# EAGLE design 16ChFNIRS (EAGLE 9.6.2)
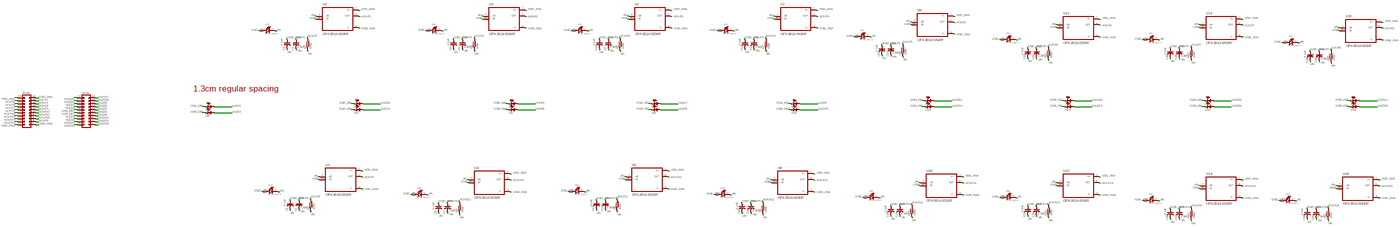
[diagram p0: schematic, sheet 1, overview]
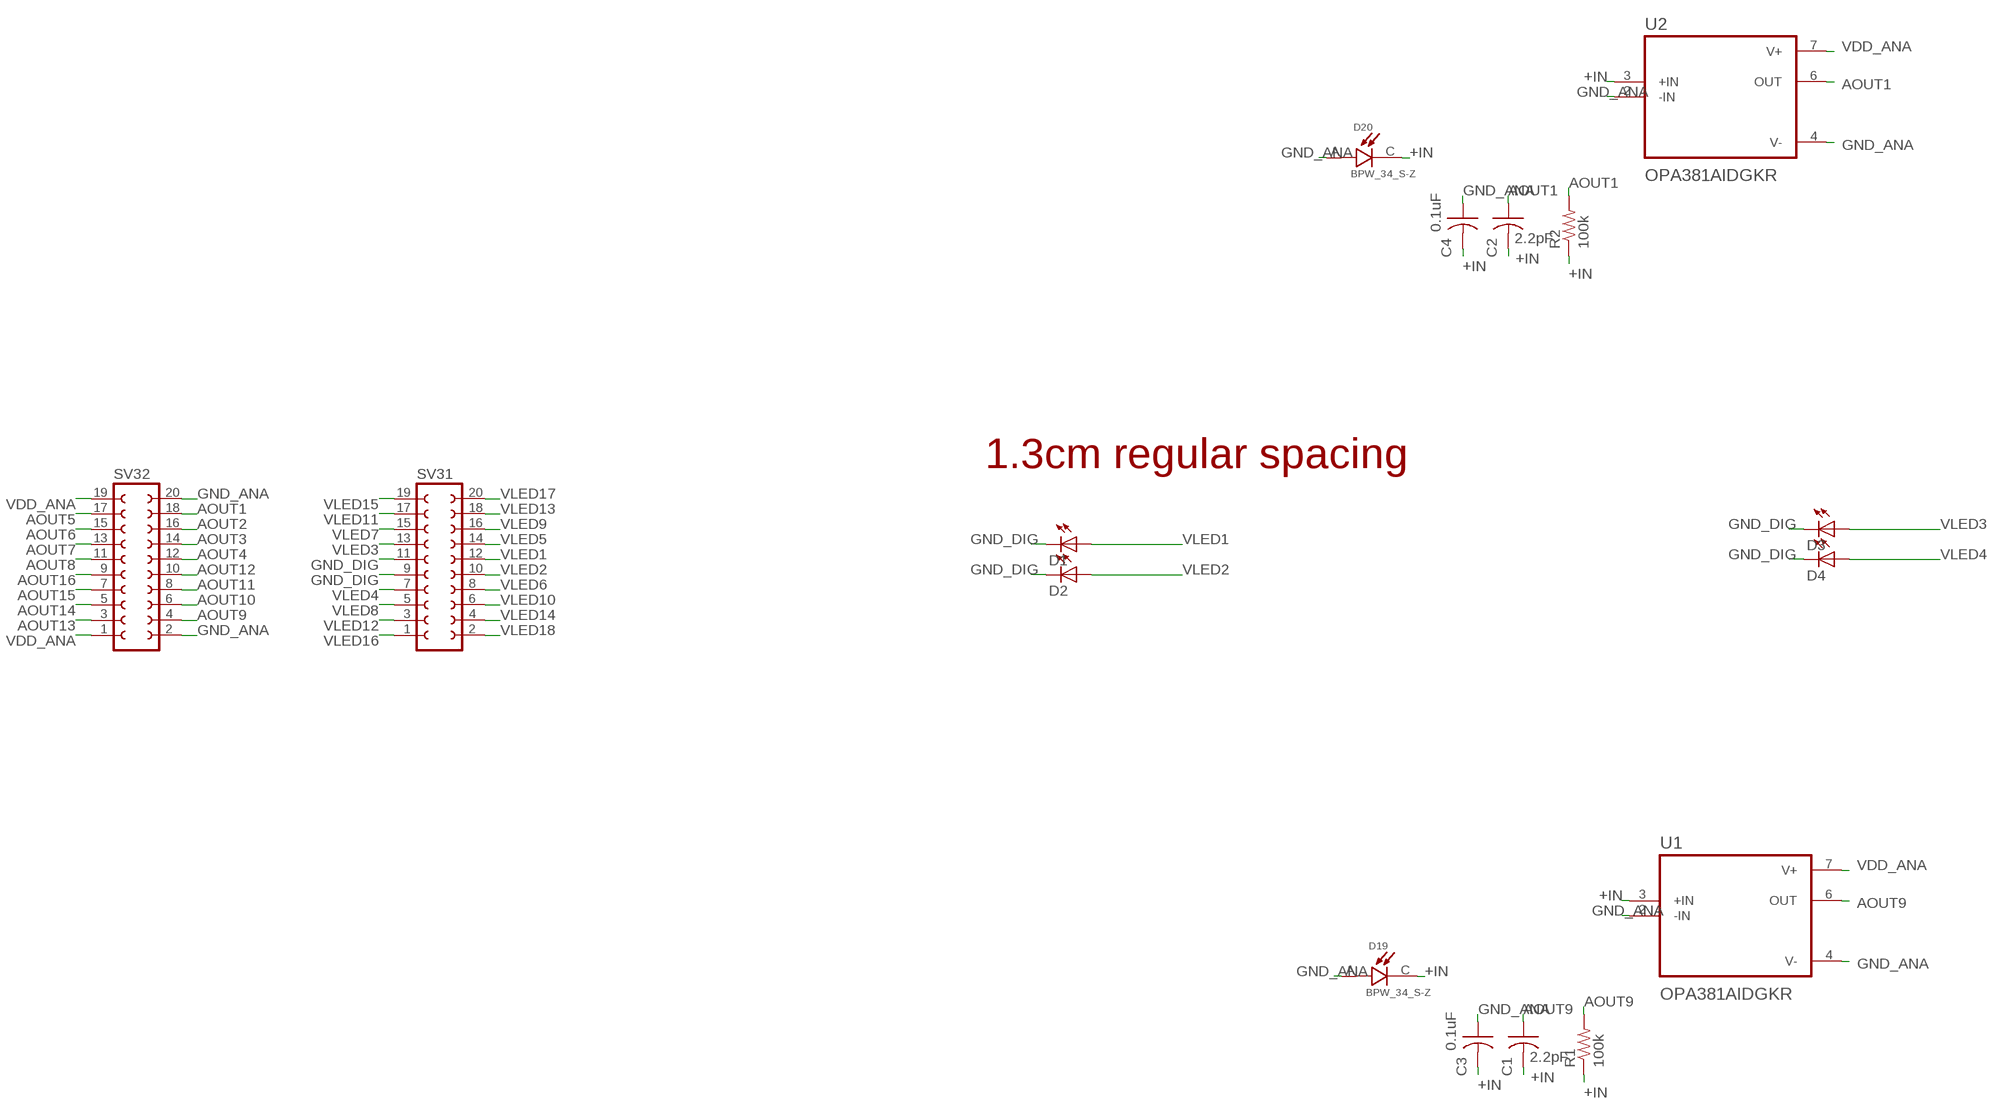
[diagram p1: schematic, sheet 1, part 1 of 4]
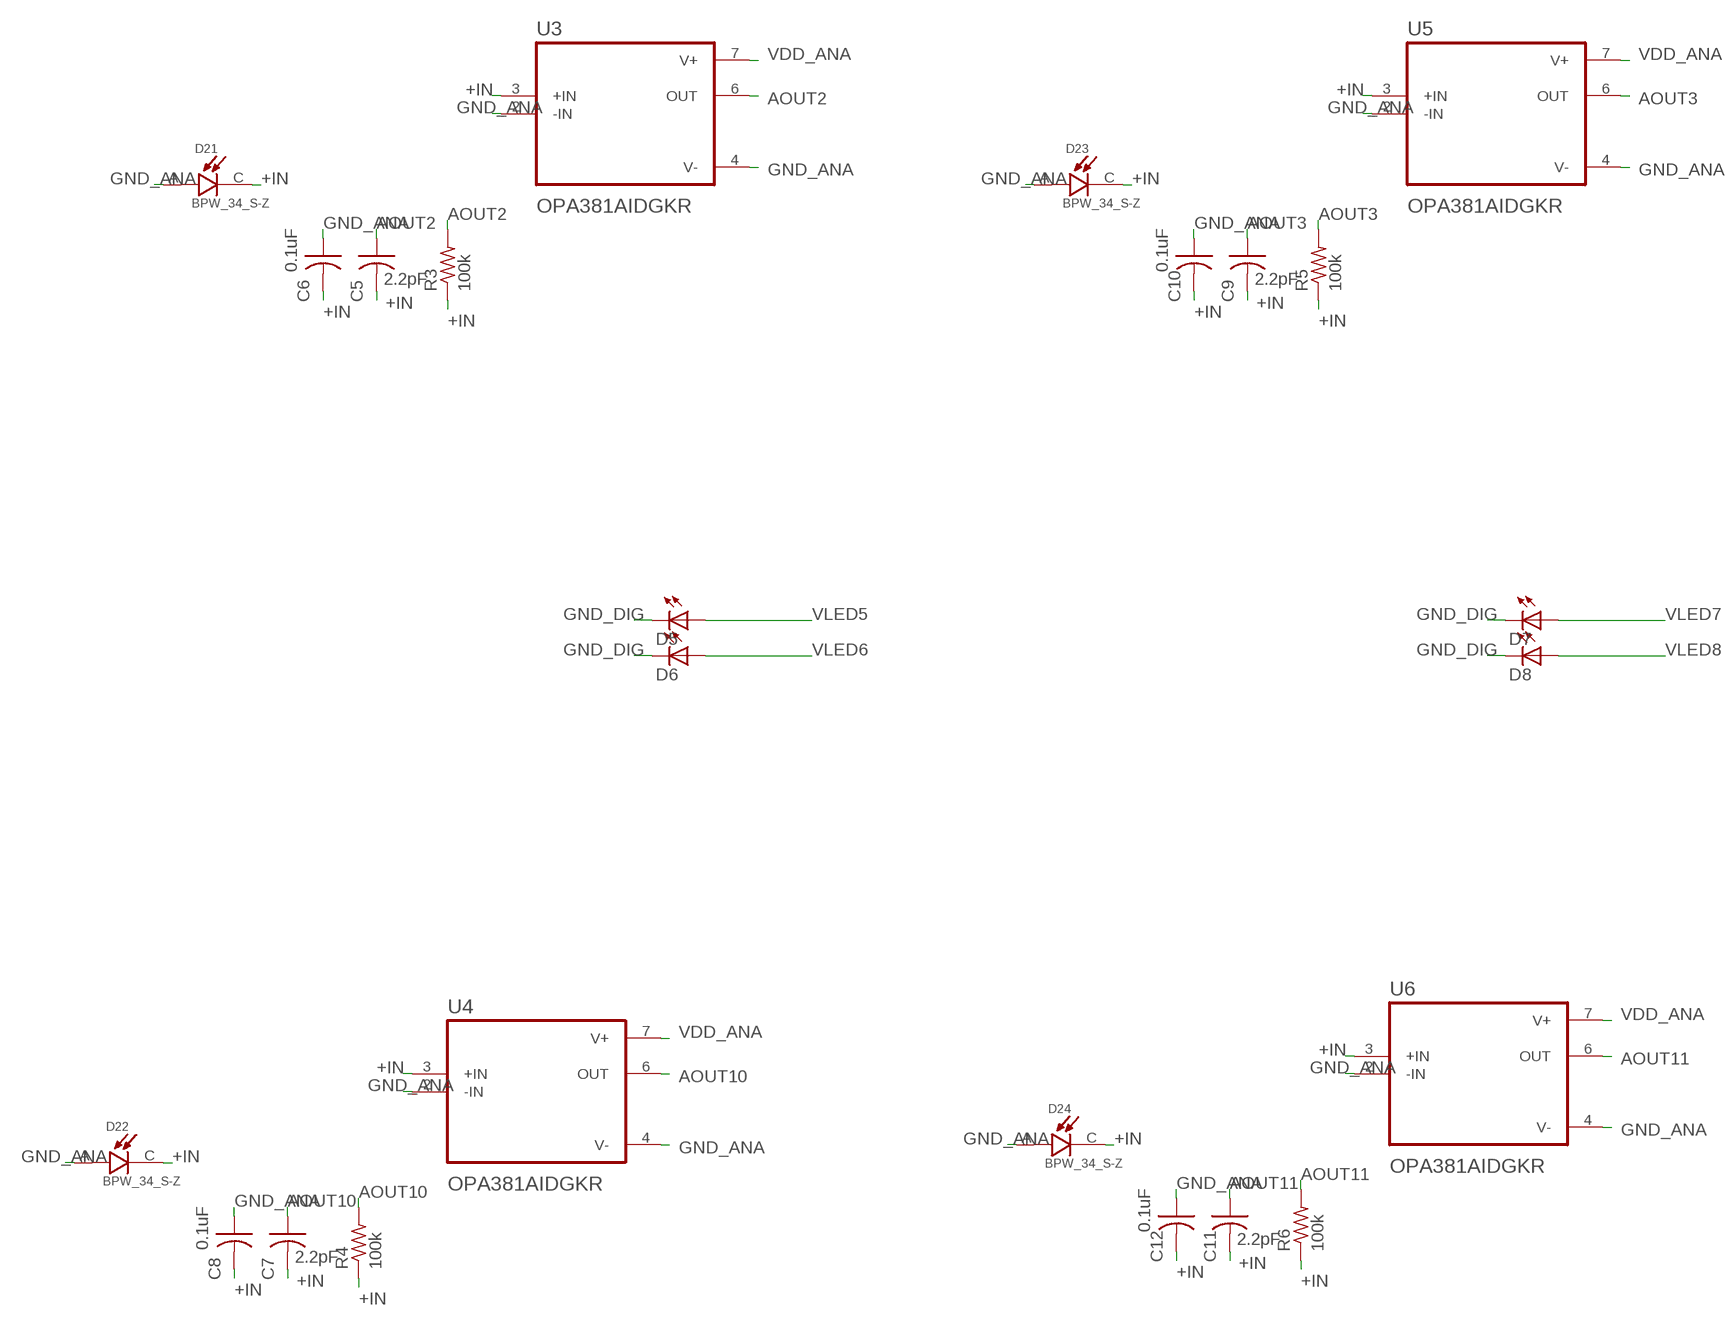
[diagram p2: schematic, sheet 1, part 2 of 4]
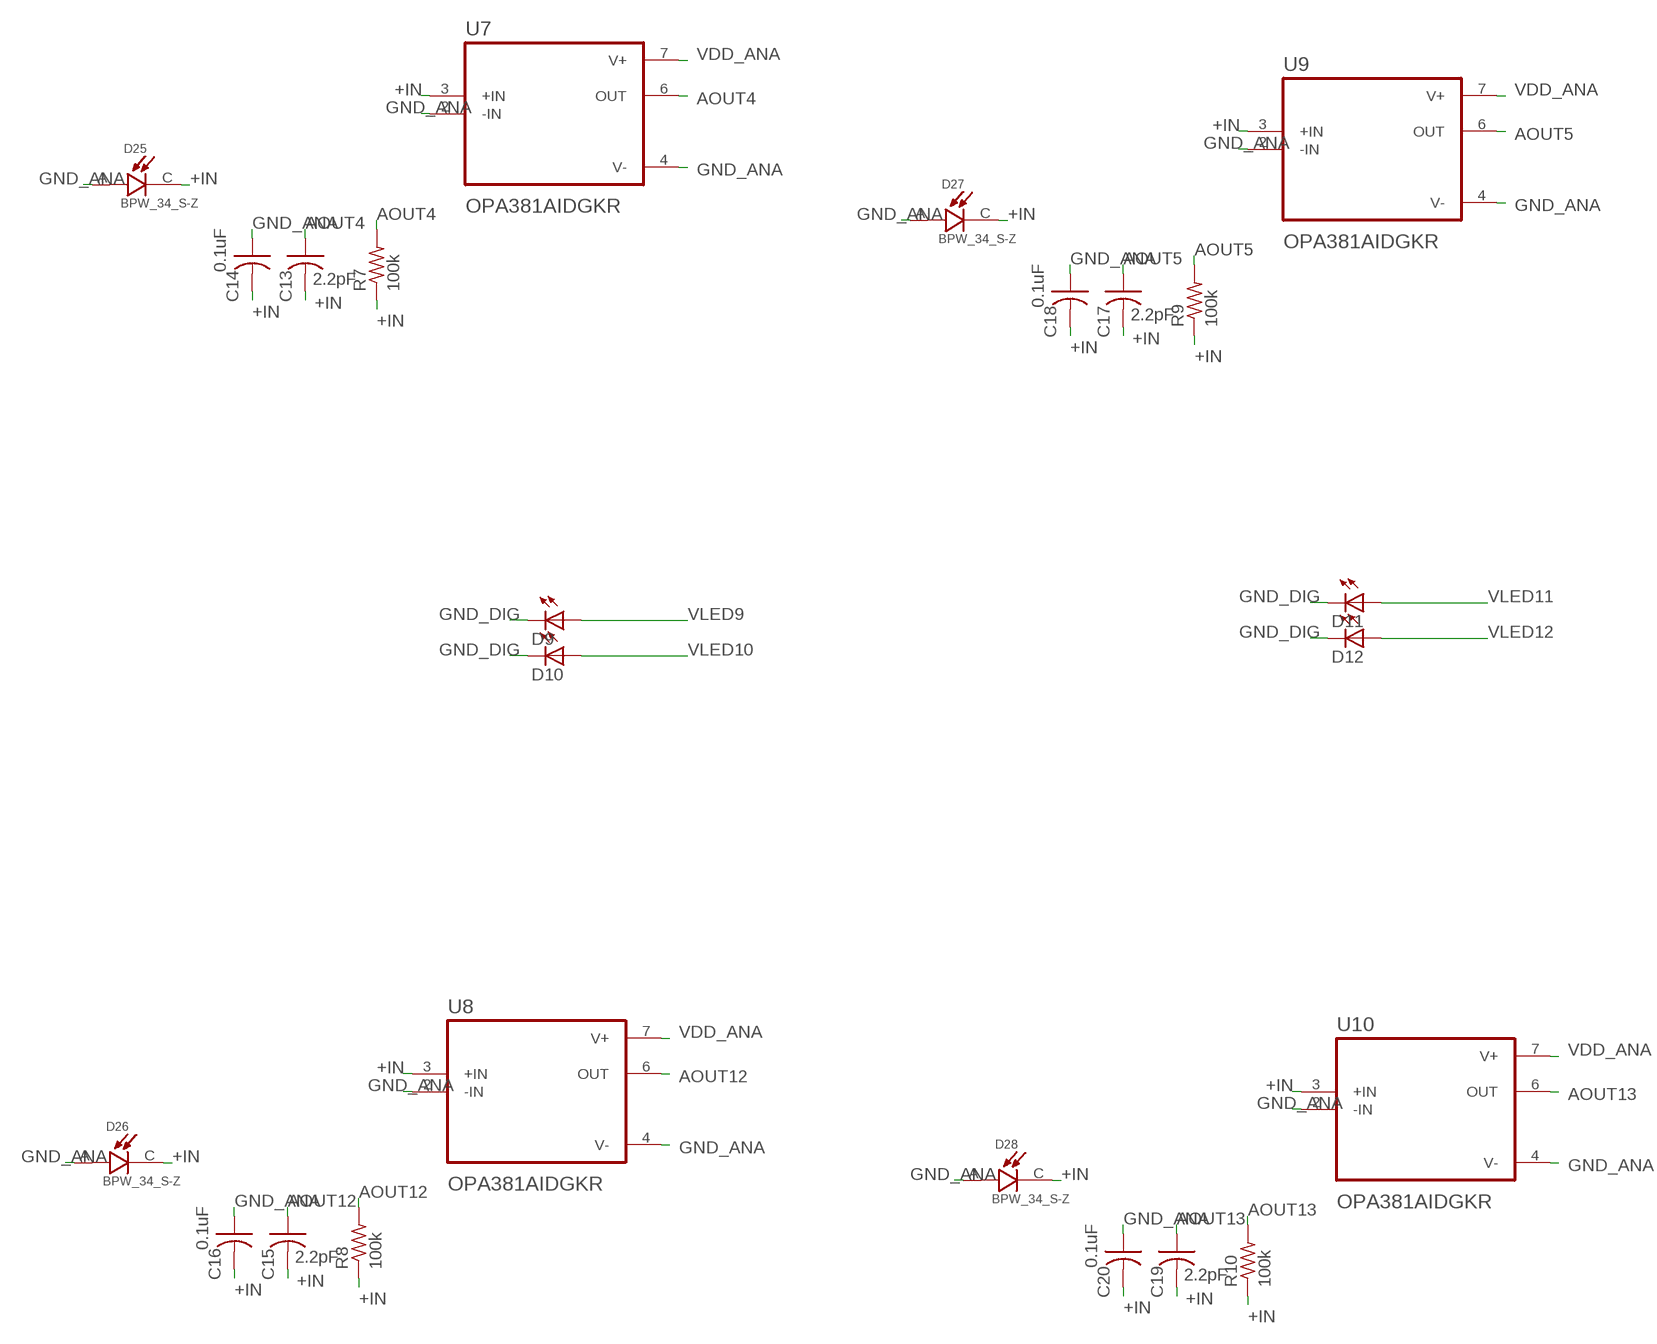
[diagram p3: schematic, sheet 1, part 3 of 4]
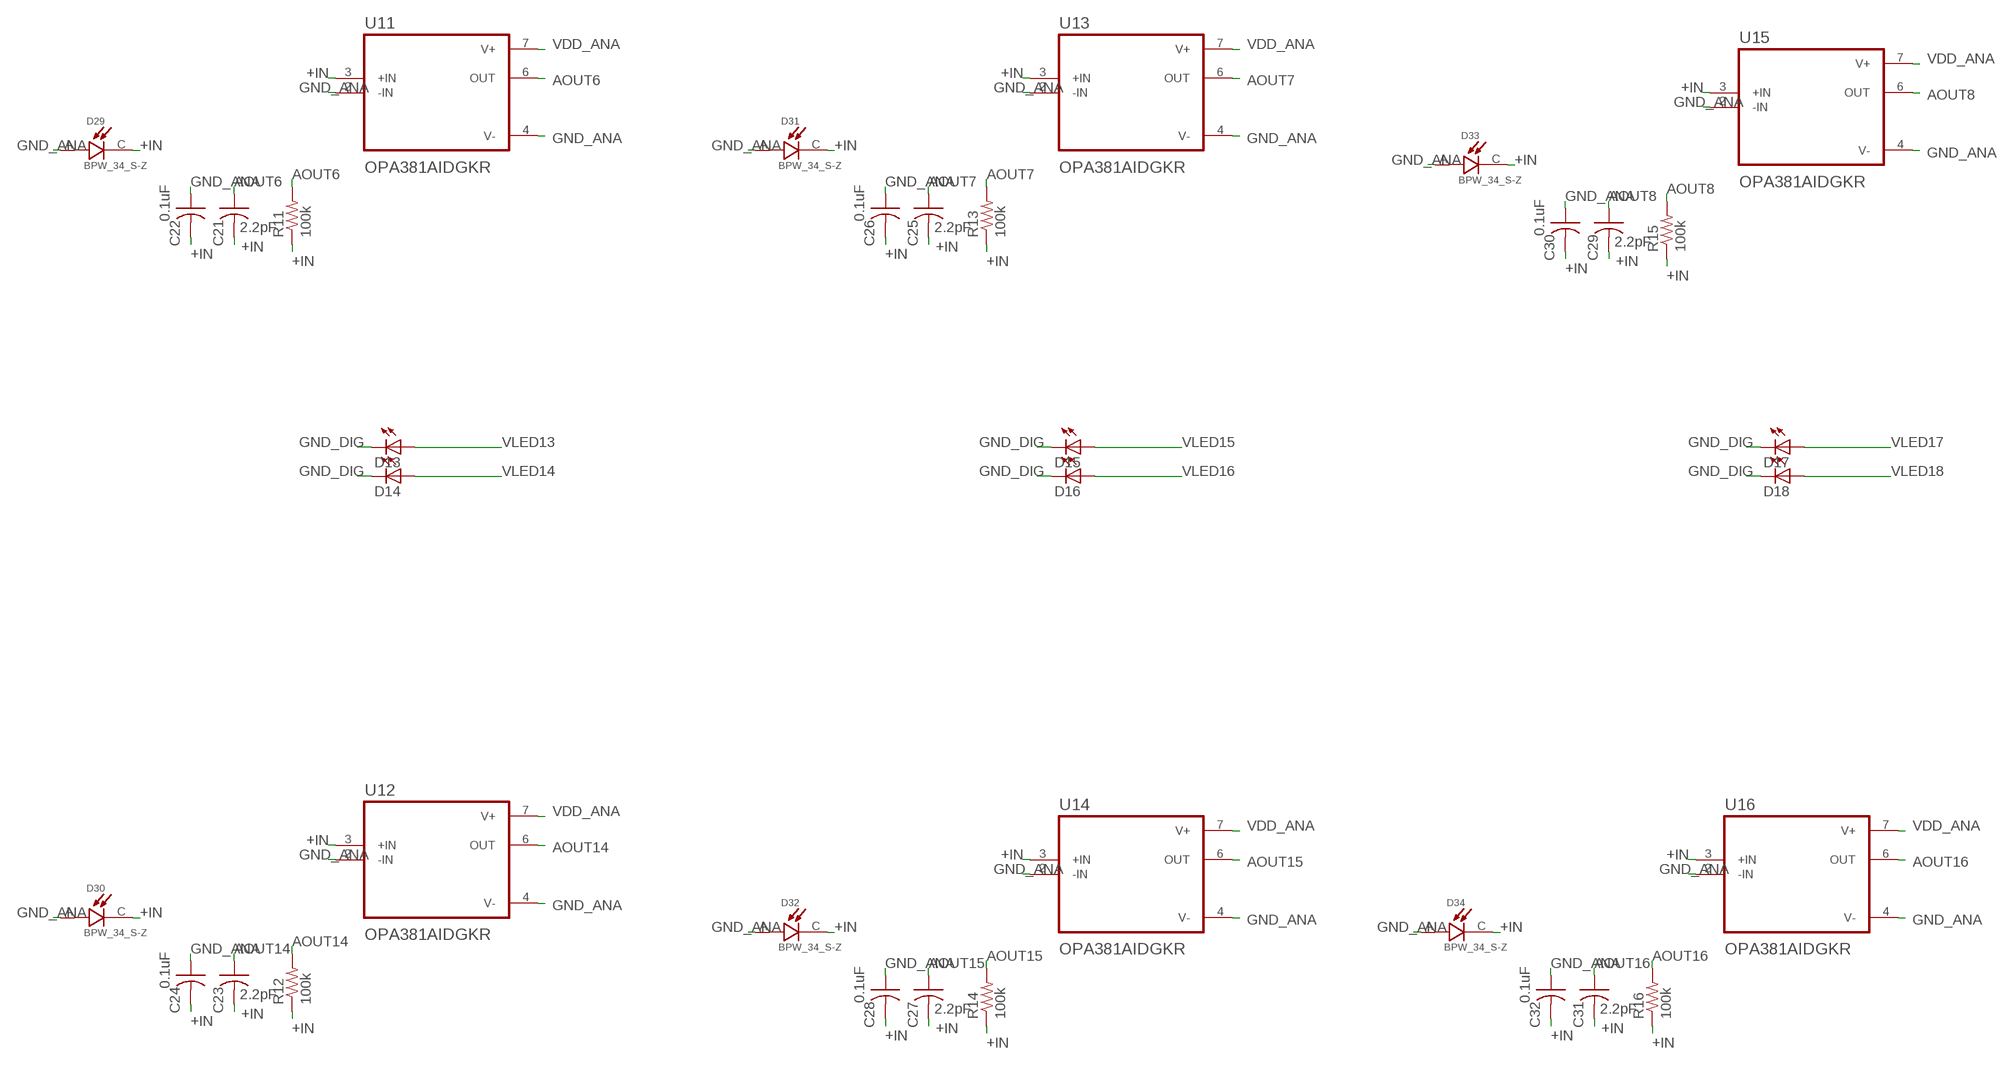
[diagram p4: schematic, sheet 1, part 4 of 4]

## Parts
C1  2.2pF  C-USC0603K  [C0603K]
C2  2.2pF  C-USC0603K  [C0603K]
C3  0.1uF  C-USC0603K  [C0603K]
C4  0.1uF  C-USC0603K  [C0603K]
C5  2.2pF  C-USC0603K  [C0603K]
C6  0.1uF  C-USC0603K  [C0603K]
C7  2.2pF  C-USC0603K  [C0603K]
C8  0.1uF  C-USC0603K  [C0603K]
C9  2.2pF  C-USC0603K  [C0603K]
C10  0.1uF  C-USC0603K  [C0603K]
C11  2.2pF  C-USC0603K  [C0603K]
C12  0.1uF  C-USC0603K  [C0603K]
C13  2.2pF  C-USC0603K  [C0603K]
C14  0.1uF  C-USC0603K  [C0603K]
C15  2.2pF  C-USC0603K  [C0603K]
C16  0.1uF  C-USC0603K  [C0603K]
C17  2.2pF  C-USC0603K  [C0603K]
C18  0.1uF  C-USC0603K  [C0603K]
C19  2.2pF  C-USC0603K  [C0603K]
C20  0.1uF  C-USC0603K  [C0603K]
C21  2.2pF  C-USC0603K  [C0603K]
C22  0.1uF  C-USC0603K  [C0603K]
C23  2.2pF  C-USC0603K  [C0603K]
C24  0.1uF  C-USC0603K  [C0603K]
C25  2.2pF  C-USC0603K  [C0603K]
C26  0.1uF  C-USC0603K  [C0603K]
C27  2.2pF  C-USC0603K  [C0603K]
C28  0.1uF  C-USC0603K  [C0603K]
C29  2.2pF  C-USC0603K  [C0603K]
C30  0.1uF  C-USC0603K  [C0603K]
C31  2.2pF  C-USC0603K  [C0603K]
C32  0.1uF  C-USC0603K  [C0603K]
D1  LED1206  [LED-1206]
D2  LED1206  [LED-1206]
D3  LED1206  [LED-1206]
D4  LED1206  [LED-1206]
D5  LED1206  [LED-1206]
D6  LED1206  [LED-1206]
D7  LED1206  [LED-1206]
D8  LED1206  [LED-1206]
D9  LED1206  [LED-1206]
D10  LED1206  [LED-1206]
D11  LED1206  [LED-1206]
D12  LED1206  [LED-1206]
D13  LED1206  [LED-1206]
D14  LED1206  [LED-1206]
D15  LED1206  [LED-1206]
D16  LED1206  [LED-1206]
D17  LED1206  [LED-1206]
D18  LED1206  [LED-1206]
D19  BPW_34_S-Z  [DIO_BPW_34_S-Z]
D20  BPW_34_S-Z  [DIO_BPW_34_S-Z]
D21  BPW_34_S-Z  [DIO_BPW_34_S-Z]
D22  BPW_34_S-Z  [DIO_BPW_34_S-Z]
D23  BPW_34_S-Z  [DIO_BPW_34_S-Z]
D24  BPW_34_S-Z  [DIO_BPW_34_S-Z]
D25  BPW_34_S-Z  [DIO_BPW_34_S-Z]
D26  BPW_34_S-Z  [DIO_BPW_34_S-Z]
D27  BPW_34_S-Z  [DIO_BPW_34_S-Z]
D28  BPW_34_S-Z  [DIO_BPW_34_S-Z]
D29  BPW_34_S-Z  [DIO_BPW_34_S-Z]
D30  BPW_34_S-Z  [DIO_BPW_34_S-Z]
D31  BPW_34_S-Z  [DIO_BPW_34_S-Z]
D32  BPW_34_S-Z  [DIO_BPW_34_S-Z]
D33  BPW_34_S-Z  [DIO_BPW_34_S-Z]
D34  BPW_34_S-Z  [DIO_BPW_34_S-Z]
R1  100k  R-US_R0603  [R0603]
R2  100k  R-US_R0603  [R0603]
R3  100k  R-US_R0603  [R0603]
R4  100k  R-US_R0603  [R0603]
R5  100k  R-US_R0603  [R0603]
R6  100k  R-US_R0603  [R0603]
R7  100k  R-US_R0603  [R0603]
R8  100k  R-US_R0603  [R0603]
R9  100k  R-US_R0603  [R0603]
R10  100k  R-US_R0603  [R0603]
R11  100k  R-US_R0603  [R0603]
R12  100k  R-US_R0603  [R0603]
R13  100k  R-US_R0603  [R0603]
R14  100k  R-US_R0603  [R0603]
R15  100k  R-US_R0603  [R0603]
R16  100k  R-US_R0603  [R0603]
SV31  FE10-2  [FE10-2]
SV32  FE10-2  [FE10-2]
U1  OPA381AIDGKR  [SOP65P490X110-8N]
U2  OPA381AIDGKR  [SOP65P490X110-8N]
U3  OPA381AIDGKR  [SOP65P490X110-8N]
U4  OPA381AIDGKR  [SOP65P490X110-8N]
U5  OPA381AIDGKR  [SOP65P490X110-8N]
U6  OPA381AIDGKR  [SOP65P490X110-8N]
U7  OPA381AIDGKR  [SOP65P490X110-8N]
U8  OPA381AIDGKR  [SOP65P490X110-8N]
U9  OPA381AIDGKR  [SOP65P490X110-8N]
U10  OPA381AIDGKR  [SOP65P490X110-8N]
U11  OPA381AIDGKR  [SOP65P490X110-8N]
U12  OPA381AIDGKR  [SOP65P490X110-8N]
U13  OPA381AIDGKR  [SOP65P490X110-8N]
U14  OPA381AIDGKR  [SOP65P490X110-8N]
U15  OPA381AIDGKR  [SOP65P490X110-8N]
U16  OPA381AIDGKR  [SOP65P490X110-8N]

## Nets
+IN: C1.2 C2.2 C3.2 C4.2 C5.2 C6.2 C7.2 C8.2 C9.2 C10.2 C11.2 C12.2 C13.2 C14.2 C15.2 C16.2 C17.2 C18.2 C19.2 C20.2 C21.2 C22.2 C23.2 C24.2 C25.2 C26.2 C27.2 C28.2 C29.2 C30.2 C31.2 C32.2 D19.C D20.C D21.C D22.C D23.C D24.C D25.C D26.C D27.C D28.C D29.C D30.C D31.C D32.C D33.C D34.C R1.1 R2.1 R3.1 R4.1 R5.1 R6.1 R7.1 R8.1 R9.1 R10.1 R11.1 R12.1 R13.1 R14.1 R15.1 R16.1 U1.3(+IN) U2.3(+IN) U3.3(+IN) U4.3(+IN) U5.3(+IN) U6.3(+IN) U7.3(+IN) U8.3(+IN) U9.3(+IN) U10.3(+IN) U11.3(+IN) U12.3(+IN) U13.3(+IN) U14.3(+IN) U15.3(+IN) U16.3(+IN)
AOUT1: C2.1 R2.2 SV32.18 U2.6(OUT)
AOUT2: C5.1 R3.2 SV32.16 U3.6(OUT)
AOUT3: C9.1 R5.2 SV32.14 U5.6(OUT)
AOUT4: C13.1 R7.2 SV32.12 U7.6(OUT)
AOUT5: C17.1 R9.2 SV32.17 U9.6(OUT)
AOUT6: C21.1 R11.2 SV32.15 U11.6(OUT)
AOUT7: C25.1 R13.2 SV32.13 U13.6(OUT)
AOUT8: C29.1 R15.2 SV32.11 U15.6(OUT)
AOUT9: C1.1 R1.2 SV32.4 U1.6(OUT)
AOUT10: C7.1 R4.2 SV32.6 U4.6(OUT)
AOUT11: C11.1 R6.2 SV32.8 U6.6(OUT)
AOUT12: C15.1 R8.2 SV32.10 U8.6(OUT)
AOUT13: C19.1 R10.2 SV32.3 U10.6(OUT)
AOUT14: C23.1 R12.2 SV32.5 U12.6(OUT)
AOUT15: C27.1 R14.2 SV32.7 U14.6(OUT)
AOUT16: C31.1 R16.2 SV32.9 U16.6(OUT)
GND_ANA: C3.1 C4.1 C6.1 C8.1 C10.1 C12.1 C14.1 C16.1 C18.1 C20.1 C22.1 C24.1 C26.1 C28.1 C30.1 C32.1 D19.A D20.A D21.A D22.A D23.A D24.A D25.A D26.A D27.A D28.A D29.A D30.A D31.A D32.A D33.A D34.A SV32.2 SV32.20 U1.2(-IN) U1.4(V-) U2.2(-IN) U2.4(V-) U3.2(-IN) U3.4(V-) U4.2(-IN) U4.4(V-) U5.2(-IN) U5.4(V-) U6.2(-IN) U6.4(V-) U7.2(-IN) U7.4(V-) U8.2(-IN) U8.4(V-) U9.2(-IN) U9.4(V-) U10.2(-IN) U10.4(V-) U11.2(-IN) U11.4(V-) U12.2(-IN) U12.4(V-) U13.2(-IN) U13.4(V-) U14.2(-IN) U14.4(V-) U15.2(-IN) U15.4(V-) U16.2(-IN) U16.4(V-)
GND_DIG: D1.C D2.C D3.C D4.C D5.C D6.C D7.C D8.C D9.C D10.C D11.C D12.C D13.C D14.C D15.C D16.C D17.C D18.C SV31.9 SV31.11
VDD_ANA: SV32.1 SV32.19 U1.7(V+) U2.7(V+) U3.7(V+) U4.7(V+) U5.7(V+) U6.7(V+) U7.7(V+) U8.7(V+) U9.7(V+) U10.7(V+) U11.7(V+) U12.7(V+) U13.7(V+) U14.7(V+) U15.7(V+) U16.7(V+)
VLED1: D1.A SV31.12
VLED2: D2.A SV31.10
VLED3: D3.A SV31.13
VLED4: D4.A SV31.7
VLED5: D5.A SV31.14
VLED6: D6.A SV31.8
VLED7: D7.A SV31.15
VLED8: D8.A SV31.5
VLED9: D9.A SV31.16
VLED10: D10.A SV31.6
VLED11: D11.A SV31.17
VLED12: D12.A SV31.3
VLED13: D13.A SV31.18
VLED14: D14.A SV31.4
VLED15: D15.A SV31.19
VLED16: D16.A SV31.1
VLED17: D17.A SV31.20
VLED18: D18.A SV31.2

## Notes on the sheet
- 1.3cm regular spacing

## Library data of the parts
C1-C32 = adafruit:C-US: CAPACITOR, American symbol
D1-D18 = epic:LED: LEDs Standard schematic elements and footprints for 5mm, 3mm, 1206, and 0603 sized LEDs. 5mm - Spark Fun Electronics SKU : COM-00529 (and others)
D19-D34 = BPW_34_S-Z:BPW_34_S-Z: Silicon PIN Photodiode Check availability <https://pricing.snapeda.com/parts/BPW%2034%20S-Z/OSRAM%20Opto/view-part?ref=eda>; AVAILABILITY: In Stock; DESCRIPTION: Photodiode 850nm 20ns 120° 2-SMD, Gull Wing; MF: OSRAM Opto; MP: BPW 34 S-Z; PACKAGE: SMD-2 OSRAM Opto Semiconductors; PRICE: None; PURCHASE-URL: https://pricing.snapeda.com/search/part/BPW 34 S-Z/?ref=eda
R1-R16 = adafruit:R-US_: RESISTOR, American symbol
SV31 SV32 = con-lsta:FE10-2: FEMALE HEADER; OC_FARNELL: unknown; OC_NEWARK: unknown
U1-U16 = OPA381AIDGKR:OPA381AIDGKR: Check availability <https://pricing.snapeda.com/parts/OPA381AIDGKR/Texas%20Instruments/view-part?ref=eda>; AVAILABILITY: In Stock; DESCRIPTION: Precision, Low Power, High-Speed Transimpedance Amplifier 8-VSSOP -40 to 125; MF: Texas Instruments; MP: OPA381AIDGKR; PACKAGE: VSSOP-8 Texas Instruments; PRICE: None; PURCHASE-URL: https://pricing.snapeda.com/search/part/OPA381AIDGKR/?ref=eda

## Board
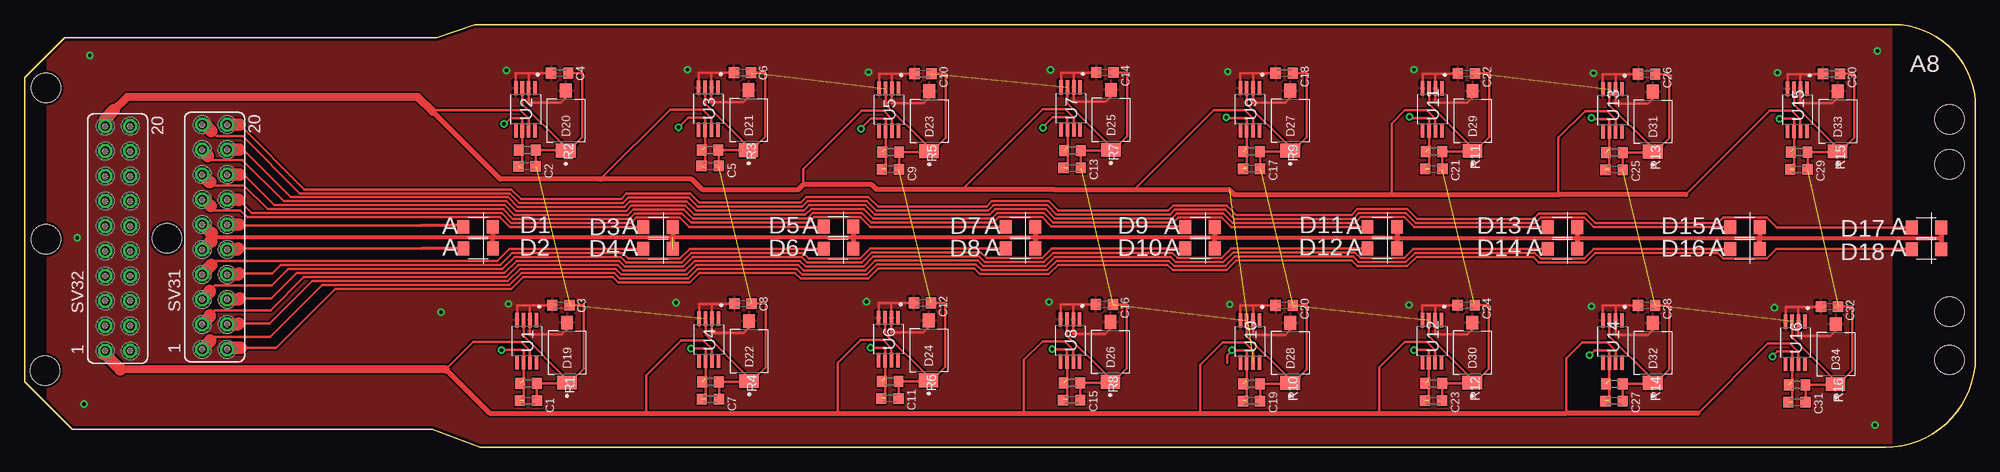
[diagram p5: board, top side]
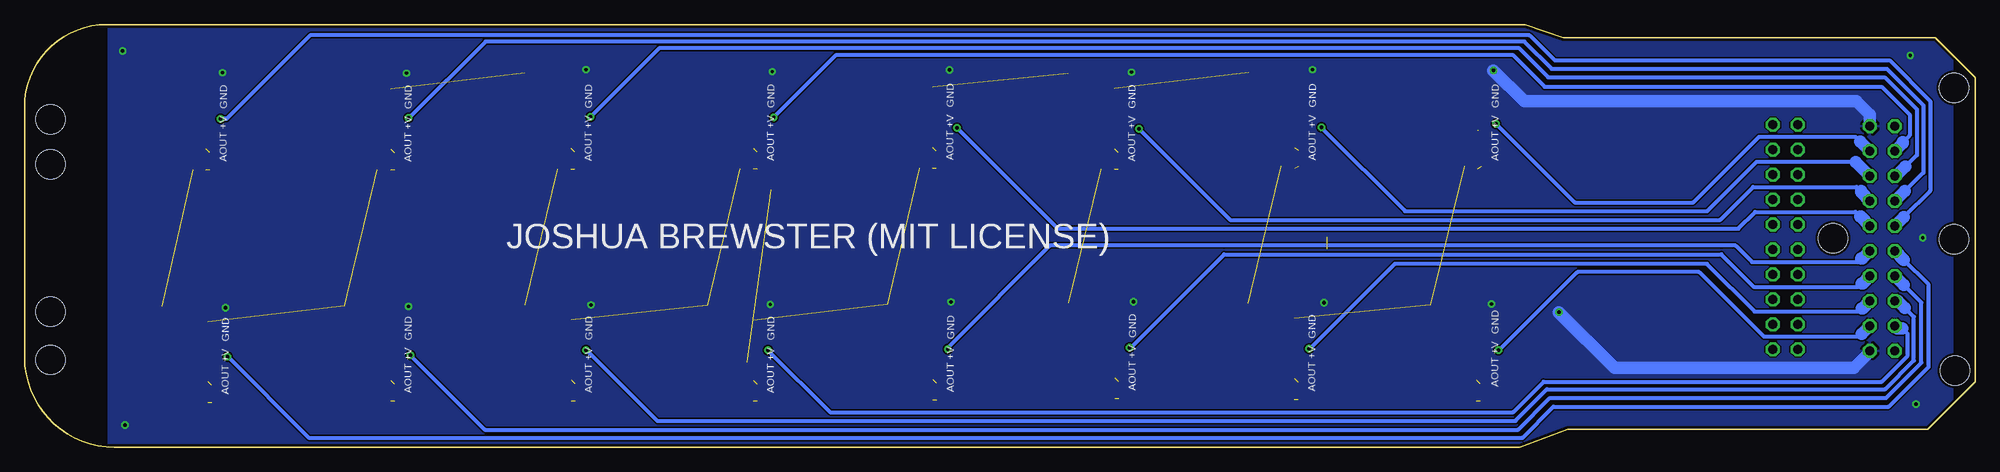
[diagram p6: board, bottom side, seen from below]

Size 198.42 x 43.03 mm. Coordinates in mm from the lower left corner, seen from the top.
Outline: 41.91,41.71 4.06,41.71 0,37.64 0,6.65 4.83,1.83 41.45,1.83 46.33,0 189.28,0 arc90 198.43,9.14 198.43,34.65 arc90 190.04,43.03 45.77,43.03 41.91,41.71
Copper layers (1*16): Top 0.035mm / dielectric 1.5mm / Bottom 0.035mm
Design rules "default *": minimum track width 6mil, minimum drill 0.35mm, track to track 6mil, track to pad 6mil, pad to pad 6mil, via to via 6mil, smd to smd 6mil, copper to edge 10mil, drill to drill 6mil, minimum pad ring 10mil, minimum via ring 8mil, stop-mask expansion 4mil, vias tented up to drill 0mil, thermal gap 10mil
Holes 3 mm at 2.17,36.58 14.47,21.28 2.17,21.18 2.07,7.78 195.77,33.38 195.77,28.78 195.77,13.78 195.77,8.88

### Footprints (pad centres in the part's own frame; a part is rotated, then mirrored left to right if it is on the bottom)
C0603K = smd 1.05 x 1.08: 1 -0.875,0; 2 0.875,0
LED-1206 = smd 1.2 x 1.4: A -1.5,0; C 1.5,0
DIO_BPW_34_S-Z = smd 1.4 x 1.2: A -3.05,0 | smd 1.4 x 2: C 3.05,0
R0603 = smd 1 x 1.1: 1 -0.85,0; 2 0.85,0
FE10-2 = drill 0.914 octagon: 1 -11.43,1.27; 2 -11.43,-1.27; 3 -8.89,1.27; 4 -8.89,-1.27; 5 -6.35,1.27; 6 -6.35,-1.27; 7 -3.81,1.27; 8 -3.81,-1.27; 9 -1.27,1.27; 10 -1.27,-1.27; 11 1.27,1.27; 12 1.27,-1.27; 13 3.81,1.27; 14 3.81,-1.27; 15 6.35,1.27; 16 6.35,-1.27; 17 8.89,1.27; 18 8.89,-1.27; 19 11.43,1.27; 20 11.43,-1.27
SOP65P490X110-8N = smd 1.47 x 0.48: 1 -2.15,0.975; 2 -2.15,0.325; 3 -2.15,-0.325; 4 -2.15,-0.975; 5 2.15,-0.975; 6 2.15,-0.325; 7 2.15,0.325; 8 2.15,0.975

### Placement (x,y rotation side)
C1  51.23,4.73 0 top
C2  51.1,28.61 0 top
C3  54.55,14.46 0 top
C4  54.43,38.08 0 top
C5  69.72,28.63 0 top
C6  73.02,38.13 0 top
C7  69.75,4.88 0 top
C8  73.07,14.61 0 top
C9  88.06,28.3 0 top
C10  91.38,38.03 0 top
C11  88.01,4.96 0 top
C12  91.33,14.68 0 top
C13  106.55,28.43 0 top
C14  109.88,38.15 0 top
C15  106.5,4.81 0 top
C16  109.82,14.53 0 top
C17  124.79,28.35 0 top
C18  128.11,38.08 0 top
C19  124.79,4.7 0 top
C20  128.11,14.43 0 top
C21  143.33,28.33 0 top
C22  146.65,38.05 0 top
C23  143.31,4.73 0 top
C24  146.63,14.46 0 top
C25  161.67,28.25 0 top
C26  164.99,37.98 0 top
C27  161.67,4.7 0 top
C28  164.99,14.43 0 top
C29  180.47,28.28 0 top
C30  183.79,38 0 top
C31  180.26,4.58 0 top
C32  183.59,14.3 0 top
D1  46.13,22.43 0 top
D2  46.15,20.22 0 top
D3  64.44,22.4 0 top
D4  64.44,20.19 0 top
D5  82.78,22.45 0 top
D6  82.78,20.19 0 top
D7  101.3,22.43 0 top
D8  101.3,20.22 0 top
D9  119.56,22.4 0 top
D10  119.56,20.22 0 top
D11  138.1,22.43 0 top
D12  138.1,20.22 0 top
D13  156.41,22.4 0 top
D14  156.41,20.19 0 top
D15  174.98,22.4 0 top
D16  174.98,20.17 0 top
D17  193.44,22.37 0 top
D18  193.44,20.16 0 top
D19  55.17,9.63 270 top
D20  55.04,33.25 270 top
D21  73.64,33.3 270 top
D22  73.69,9.78 270 top
D23  92,33.2 270 top
D24  91.95,9.86 270 top
D25  110.49,33.32 270 top
D26  110.44,9.7 270 top
D27  128.73,33.25 270 top
D28  128.73,9.6 270 top
D29  147.27,33.22 270 top
D30  147.25,9.63 270 top
D31  165.61,33.15 270 top
D32  165.61,9.6 270 top
D33  184.41,33.17 270 top
D34  184.2,9.47 270 top
R1  51.25,6.48 180 top
R2  51.13,30.26 180 top
R3  69.72,30.26 180 top
R4  69.77,6.63 180 top
R5  88.08,30.05 180 top
R6  88.03,6.71 180 top
R7  106.58,30.18 180 top
R8  106.53,6.56 180 top
R9  124.81,30.1 180 top
R10  124.81,6.46 180 top
R11  143.36,30.08 180 top
R12  143.33,6.48 180 top
R13  161.69,30 180 top
R14  161.69,6.46 180 top
R15  180.49,30.03 180 top
R16  180.29,6.33 180 top
SV31  19.32,21.39 90 top
SV32  9.46,21.24 90 top
U1  51.07,10.78 270 top
U2  50.94,34.4 270 top
U3  69.54,34.46 270 top
U4  69.59,10.93 270 top
U5  87.9,34.35 270 top
U6  87.85,11.01 270 top
U7  106.39,34.48 270 top
U8  106.34,10.86 270 top
U9  124.63,34.4 270 top
U10  124.63,10.76 270 top
U11  143.17,34.38 270 top
U12  143.15,10.78 270 top
U13  161.51,34.3 270 top
U14  161.51,10.76 270 top
U15  180.31,34.33 270 top
U16  180.1,10.63 270 top

### Tracks (layer width: path | path; a pad name or v marks a point on that pad's centre or on a via)
+IN  (15 unrouted)
  Top 0.254: U2.3 50.62,34.94 54.78,30.78 55.34,30.78 D20.C | C4.2 56.72,38.08 56.72,31.58 55.6,30.45 D20.C | D20.C 54.99,30.26 R2.1 C2.2 | U3.3 69.21,35 73.37,30.84 73.94,30.84 D21.C | C6.2 75.32,38.13 75.32,31.63 74.19,30.5 D21.C | D21.C 73.63,30.26 R3.1 70.58,30.26 70.58,28.65 C5.2 | U4.3 69.26,11.48 73.42,7.31 73.99,7.31 D22.C | C8.2 75.37,14.61 75.37,8.11 74.24,6.98 D22.C | D22.C 73.57,6.63 R4.1 70.63,6.63 70.63,4.89 C7.2 | U5.3 87.58,34.89 91.74,30.73 92.3,30.73 D23.C | C10.2 93.68,38.03 93.68,31.53 92.55,30.4 D23.C | D23.C 91.88,30.05 R5.1 88.95,30.05 C9.2 | U6.3 87.53,11.55 91.69,7.39 92.25,7.39 D24.C | C12.2 93.63,14.68 93.63,8.19 92.5,7.06 D24.C | D24.C 91.83,6.71 R6.1 88.9,6.71 88.9,4.97 C11.2 | U7.3 106.07,35.02 110.23,30.86 110.79,30.86 D25.C | C14.2 112.17,38.15 112.17,31.66 111.05,30.53 D25.C | D25.C 110.37,30.18 R7.1 107.44,28.44 C13.2 | U8.3 106.02,11.4 110.18,7.24 110.74,7.24 D26.C | C16.2 112.12,14.53 112.12,8.03 110.99,6.91 D26.C | D26.C 110.32,6.56 R8.1 C15.2 | U9.3 124.31,34.94 128.47,30.78 129.03,30.78 D27.C | C18.2 130.41,38.08 130.41,31.58 129.28,30.45 D27.C | D27.C 128.61,30.1 R9.1 125.67,30.1 C17.2 | U10.3 124.31,11.3 128.47,7.14 129.03,7.14 D28.C | C20.2 130.41,14.43 130.41,7.93 129.28,6.81 D28.C | D28.C 128.61,6.46 R10.1 125.67,6.46 C19.2 | U11.3 142.85,34.92 147.01,30.76 147.57,30.76 D29.C | C22.2 148.95,38.05 148.95,31.55 147.82,30.43 D29.C | D29.C 147.15,30.08 R11.1 C21.2 | U12.3 142.82,11.32 146.98,7.16 147.55,7.16 D30.C | C24.2 148.93,14.45 148.93,7.96 147.8,6.83 D30.C | D30.C 147.12,6.48 R12.1 144.19,6.48 144.19,4.74 C23.2 | U13.3 161.19,34.84 165.35,30.68 165.91,30.68 D31.C
  Top 0.254: C26.2 167.29,37.98 167.29,31.48 166.16,30.35 D31.C | D31.C 165.49,30 R13.1 162.56,30 C25.2 | U14.3 161.19,11.3 165.35,7.14 165.91,7.14 D32.C | C28.2 167.29,14.43 167.29,7.93 166.16,6.81 D32.C | D32.C 165.49,6.46 R14.1 162.56,6.46 C27.2 | U15.3 179.98,34.87 184.14,30.71 184.71,30.71 D33.C | C30.2 186.08,38 186.08,31.5 184.96,30.38 D33.C | D33.C 184.29,30.03 R15.1 181.35,30.03 181.35,28.28 C29.2 | U16.3 179.78,11.17 183.94,7.01 184.5,7.01 D34.C | C32.2 185.88,14.3 185.88,7.81 184.76,6.68 D34.C | D34.C 184.08,6.33 R16.1 C31.2 | U1.3 50.75,11.32 54.91,7.16 55.47,7.16 D19.C | C3.2 56.85,14.45 56.85,7.96 55.72,6.83 D19.C | D19.C 55.05,6.48 R1.1 52.12,6.48 52.12,4.74 C1.2
AOUT1  (via drill 0.35)  (2 unrouted)
  Top 0.254: U2.6 50.62,33.51 49.46,33.51 48.82,32.87 v48.77,32.92 | 50.63,28.35 50.63,30.26 R2.2 50.63,30.61 50.63,32.24
  Bottom 0.406: v48.77,32.92 40.76,24.91 28.68,24.91 21.99,31.6 12.21,31.6 11.73,31.12
  Bottom 1.27: SV32.18 11.72,31.12 11.73,31.12
AOUT2  (via drill 0.35)  (2 unrouted)
  Top 0.254: 69.22,30.51 69.22,32.29 U3.6 69.21,33.56 67.49,33.56 66.52,32.59 v66.52,32.56 | 69.23,28.4 69.23,30.26 R3.2
  Bottom 0.406: v66.52,32.56 58,24.03 27.29,24.03 22.27,29.05 12.19,29.05
  Bottom 1.27: SV32.16 12.19,29.04 12.19,29.05
AOUT3  (via drill 0.35)  (2 unrouted)
  Top 0.254: 87.59,28.3 87.59,30.05 R5.2 | 87.59,30.41 87.59,32.19 U5.6 87.58,33.46 86.09,33.46 85.06,32.44 v85.06,32.39
  Bottom 0.406: v85.06,32.39 75.81,23.13 25.97,23.13 22.6,26.5 12.08,26.5 11.64,26.06
  Bottom 1.27: SV32.14 11.64,25.95 11.64,26.06
AOUT4  (via drill 0.35)  (2 unrouted)
  Top 0.254: 106.08,28.43 106.08,30.18 R7.2 | 106.08,30.53 106.08,32.32 U7.6 106.07,33.59 104.58,33.59 103.61,32.62 v103.61,32.53
  Bottom 0.406: v103.61,32.53 93.32,22.24 24.12,22.24 22.4,23.96 12.2,23.96 11.7,23.46
  Bottom 1.27: SV32.12 11.68,23.46 11.7,23.46
AOUT5  (via drill 0.35)  (2 unrouted)
  Top 0.254: 124.32,28.35 124.32,30.1 R9.2 | 124.32,30.46 124.32,32.24 U9.6 124.31,33.51 122.81,33.51 122.29,33.51 v122.23,33.58
  Bottom 0.406: v122.23,33.58 115.85,39.95 47.07,39.95 43.82,36.7 9.55,36.7 6.7,33.86 6.7,31.73 7.37,31.07
  Bottom 1.27: SV32.17 7.37,30.95 7.37,31.07
AOUT6  (via drill 0.35)  (2 unrouted)
  Top 0.254: 142.86,28.33 142.86,30.08 R11.2 | 142.86,30.43 U11.6 142.85,33.49 140.98,33.49 v140.84,33.62 v140.84,33.63
  Bottom 0.406: v140.84,33.63 133.81,40.66 46.47,40.66 43.47,37.66 9.22,37.66 5.97,34.4 5.97,29.72 7.13,28.55
  Bottom 1.27: 7.13,28.55 8.1,27.59 SV32.15
AOUT7  (via drill 0.35)  (2 unrouted)
  Top 0.254: 161.2,28.25 161.2,30 R13.2 | 161.2,30.36 161.2,32.14 U13.6 161.19,33.41 159.69,33.41 159.62,33.48 159.38,33.48 v159.36,33.51
  Bottom 0.406: 7.19,26.06 5.29,27.95 5.29,34.82 9.01,38.53 43.11,38.53 45.87,41.3 151.54,41.3 159.33,33.51 v159.36,33.51
  Bottom 1.27: 7.19,26.06 8.19,25.06 SV32.13
AOUT8  (via drill 0.35)  (2 unrouted)
  Top 0.254: 180,28.27 180,30.03 R15.2 | 180,30.38 180,32.17 U15.6 179.98,33.44 v178.49,33.44
  Bottom 0.406: 7.27,23.42 4.6,26.1 4.6,35.25 8.73,39.38 42.79,39.38 45.34,41.94 169.37,41.94 177.88,33.44 v178.49,33.44
  Bottom 1.27: 7.27,23.42 SV32.11
AOUT9  (via drill 0.35)  (2 unrouted)
  Top 0.254: 50.76,4.73 50.76,6.48 R1.2 | 50.76,6.84 50.76,8.62 U1.6 50.75,9.89 v48.49,9.89
  Bottom 0.406: 11.58,11.54 11.87,11.25 21.53,11.25 28.11,17.84 40.48,17.84 48.43,9.89 v48.49,9.89
  Bottom 1.27: SV32.4 11.54,11.54 11.58,11.54
AOUT10  (via drill 0.35)  (2 unrouted)
  Top 0.254: 69.28,4.88 69.28,6.63 R4.2 | 69.28,6.99 69.28,8.77 U4.6 69.26,10.04 v67.77,10.04
  Bottom 0.406: 11.56,14.14 11.91,13.79 22.45,13.79 27.33,18.67 59.05,18.67 67.68,10.04 v67.77,10.04
  Bottom 1.27: SV32.6 11.48,14.14 11.56,14.14
AOUT11  (via drill 0.35)  (2 unrouted)
  Top 0.254: 87.54,4.96 87.54,6.71 R6.2 | 87.54,7.07 87.54,8.85 U6.6 87.53,10.12 v86.03,10.12
  Bottom 0.406: 11.54,16.68 11.9,16.32 22.55,16.32 25.85,19.62 76.42,19.62 85.92,10.12 v86.03,10.12
  Bottom 1.27: SV32.8 11.48,16.68 11.54,16.68
AOUT12  (via drill 0.35)  (2 unrouted)
  Top 0.254: 106.03,4.81 106.03,6.56 R8.2 | 106.03,6.91 U8.6 106.02,9.97 v104.53,9.97
  Bottom 0.406: 11.63,19.18 11.97,18.85 22.72,18.85 24.39,20.52 94.13,20.52 104.53,10.13 v104.53,9.97
  Bottom 1.27: SV32.10 11.52,19.18 11.63,19.18
AOUT13  (via drill 0.35)  (2 unrouted)
  Top 0.254: 124.32,4.7 124.32,6.46 R10.2 | 124.32,6.81 124.32,8.59 U10.6 124.31,9.87 v122.81,9.87 122.31,9.36 122.31,8.6
  Bottom 0.406: 7.44,12.09 6.89,11.53 6.89,9.3 9.53,6.66 43.93,6.66 47.03,3.55 116.5,3.55 v122.81,9.87
  Bottom 1.27: SV32.3 7.93,12.09 7.44,12.09
AOUT14  (via drill 0.35)  (2 unrouted)
  Top 0.254: 142.84,4.73 142.84,6.48 R12.2 | 142.83,6.84 142.83,8.62 U12.6 142.82,9.89 v141.33,9.89
  Bottom 0.406: 7.17,14.18 6.26,13.27 6.26,8.81 9.19,5.89 43.59,5.89 46.8,2.68 134.07,2.68 141.28,9.89 v141.33,9.89
  Bottom 1.27: 7.17,14.18 7.88,14.89 SV32.5
AOUT15  (via drill 0.35)  (2 unrouted)
  Top 0.254: 161.2,4.7 161.2,6.46 R14.2 | 161.2,6.81 161.2,8.59 U14.6 161.19,9.87 159.69,9.87 v159.19,9.36
  Bottom 0.406: 7.27,16.49 5.49,14.72 5.49,8.59 9.08,5 43.29,5 46.5,1.79 151.61,1.79 159.14,9.31 v159.19,9.36
  Bottom 1.27: 7.27,16.49 SV32.7
AOUT16  (via drill 0.35)  (2 unrouted)
  Top 0.254: 179.79,4.58 179.79,6.33 R16.2 | 179.79,6.68 179.79,8.47 U16.6 179.78,9.74 178.29,9.74 v177.79,9.24
  Bottom 0.406: 7.29,19.08 4.77,16.56 4.77,8.16 8.82,4.11 42.92,4.11 46.06,0.97 169.54,0.97 177.79,9.22 v177.79,9.24
  Bottom 1.27: 7.29,19.08 8.18,19.97 SV32.9
GND_ANA  (via drill 0.35)
  Top 0.254: D20.A 55.23,35.8 54.52,35.09 51.27,35.09 U2.2 51.27,38.05 | C4.1 53.53,38.05 51.27,38.05 | 51.27,38.05 49.97,38.05 U2.4 | D21.A 73.82,35.85 73.12,35.15 69.86,35.15 U3.2 69.86,38.1 | C6.1 72.12,38.1 69.86,38.1 | 69.86,38.1 68.56,38.1 U3.4 | D22.A 73.87,12.33 73.17,11.63 69.91,11.63 U4.2 69.91,14.58 | C8.1 72.17,14.58 69.91,14.58 | 69.91,14.58 68.61,14.58 U4.4 | D23.A 92.18,35.75 91.48,35.04 88.23,35.04 U5.2 88.23,38 | C10.1 90.49,38 88.23,38 | 88.23,38 86.93,38 U5.4 | D24.A 92.13,12.4 91.43,11.7 88.18,11.7 U6.2 88.18,14.66 | C12.1 90.44,14.66 88.18,14.66 | 88.18,14.66 86.88,14.66 U6.4 | D25.A 110.67,35.87 109.97,35.17 106.72,35.17 U7.2 106.72,38.13 | C14.1 108.98,38.13 106.72,38.13 | 106.72,38.13 105.42,38.13 U7.4 | D26.A 110.62,12.25 109.92,11.55 106.67,11.55 U8.2 106.67,14.51 | C16.1 108.93,14.51 106.67,14.51 | 106.67,14.51 105.37,14.51 U8.4 | D27.A 128.91,35.8 128.21,35.09 124.95,35.09 U9.2 124.95,38.05 | C18.1 127.22,38.05 124.95,38.05 | 124.95,38.05 123.66,38.05 U9.4 | D28.A 128.91,12.15 128.21,11.45 124.95,11.45 U10.2 124.95,14.41 | C20.1 127.22,14.41 124.95,14.41 | 124.95,14.41 123.66,14.41 U10.4 | D29.A 147.45,35.77 146.75,35.07 143.5,35.07 U11.2 143.5,38.03 | C22.1 145.76,38.03 143.5,38.03 | 143.5,38.03 142.2,38.03 U11.4 | D30.A 147.43,12.18 146.73,11.47 143.47,11.47 U12.2 143.47,14.43 | C24.1 145.73,14.43 143.47,14.43 | 143.47,14.43 142.17,14.43 U12.4 | D31.A 165.79,35.7 165.09,34.99 161.84,34.99 U13.2 161.84,37.95 | C26.1 164.1,37.95 161.84,37.95 | 161.84,37.95 160.54,37.95 U13.4 | D32.A 165.79,12.15 165.09,11.45 161.84,11.45 U14.2 161.84,14.41 | C28.1 164.1,14.41 161.84,14.41
  Top 0.254: 161.84,14.41 160.54,14.41 U14.4 | D33.A 184.59,35.72 183.88,35.02 180.63,35.02 U15.2 180.63,37.98 | C30.1 182.89,37.98 180.63,37.98 | 180.63,37.98 179.33,37.98 U15.4 | D34.A 184.38,12.02 183.68,11.32 180.43,11.32 U16.2 180.43,14.28 | C32.1 182.69,14.28 180.43,14.28 | 180.43,14.28 179.13,14.28 U16.4 | D19.A 55.35,12.18 54.65,11.47 51.4,11.47 U1.2 51.4,14.43 | C3.1 53.66,14.43 51.4,14.43 | 51.4,14.43 50.1,14.43 U1.4
  Bottom 1.27: SV32.20 10.73,33.85 12.12,35.23 45.9,35.23 v49.02,38.35 | SV32.2 10.73,9.71 12.38,8.06 36.69,8.06 v42.37,13.74
  other vias: 5.36,21.31 188.44,40.34 178.31,38.13 159.56,38.07 141.33,38.43 122.38,38.23 104.34,38.4 85.85,38.18 67.44,38.43 66.27,14.71 85.65,14.81 104.22,14.78 122.58,14.53 140.82,14.48 159.36,14.33 178,14.2 188.19,2.24 6.63,39.88 6.05,4.37 49.2,14.58
  pour Bottom: 2.29,1.57 2.29,41.71 41.91,41.71 41.91,45.77 189.89,45.77 189.89,-3.25 41.43,-3.25 41.43,1.57
  pour Top: 2.29,41.71 41.91,41.71 41.91,45.77 189.89,45.77 189.89,-3.25 41.43,-3.25 41.43,1.57 2.29,1.57
GND_DIG  (1 unrouted)
  Top 0.406: 60.85,21.35 65.94,21.35 84.25,21.35 84.28,21.37 84.31,21.35 102.8,21.35 120.95,21.35 121.06,21.24 121.1,21.29 139.6,21.29 139.63,21.25 157.91,21.25 176.46,21.25 176.48,21.23 194.95,21.23 | 60.85,21.35 60.85,21.34 | 60.85,21.35 47.63,21.35 47.62,21.35 19.45,21.35 19.45,21.36 | 19.02,21.78 19.45,21.36 | 19.45,21.36 19.03,20.94 19.01,20.94
  Top 0.508: D1.C 47.63,21.35 47.63,20.24 D2.C | D17.C 194.95,22.36 194.95,21.23 194.95,20.17 D18.C | D3.C 65.94,21.41 | D4.C 65.94,21.35 | D5.C 84.28,21.37 D6.C | D7.C 102.8,21.35 D8.C | D9.C 121.06,21.24 D10.C | D11.C 139.6,21.29 D12.C | D13.C 157.91,21.25 D14.C | D15.C 176.48,21.23 D16.C
  Top 1.27: SV31.11 18.93,21.78 19.02,21.78 | SV31.9 18.88,20.94 19.01,20.94
VDD_ANA  (1 unrouted)
  Top 0.254: U2.7 51.27,33.46 50.41,34.32 41.66,34.32 41.49,34.15 | U3.7 69.86,33.51 69,34.37 65.67,34.37 58.57,27.28 | U4.7 69.91,9.99 69.05,10.85 66.8,10.85 63.25,7.29 63.25,3.45 | U5.7 88.23,33.41 87.36,34.27 85.17,34.27 | 85.17,34.27 85.12,34.27 | U6.7 88.18,10.06 87.31,10.93 85.06,10.93 82.73,8.59 82.73,3.45 | U7.7 106.72,33.53 105.85,34.4 103.54,34.4 95.4,26.26 | U8.7 106.67,9.91 105.8,10.77 103.56,10.77 101.65,8.87 101.65,3.45 | U9.7 124.95,33.46 124.09,34.32 120.95,34.32 112.85,26.22 | U10.7 124.95,9.81 124.09,10.67 121.84,10.67 119.56,8.39 119.56,3.45 | U11.7 143.5,33.43 142.63,34.29 140.39,34.29 139.04,32.95 139.04,25.7 | U12.7 143.47,9.83 142.61,10.7 140.36,10.7 137.8,8.13 137.8,3.45 | U13.7 161.84,33.35 160.97,34.22 158.73,34.22 156.01,31.5 156.01,25.7 | U14.7 161.84,9.81 160.97,10.67 158.44,10.67 156.79,9.02 156.79,3.45 | U15.7 180.63,33.38 179.77,34.24 177.52,34.24 168.98,25.7 | U16.7 180.43,9.68 179.56,10.55 177.32,10.55 170.22,3.45 | U1.7 51.4,9.83 50.53,10.7 45.64,10.7 42.85,7.91 | 79.19,26.72 79.19,28.29 85.17,34.27
  Top 0.508: 122.54,26.22 112.85,26.22 104.76,26.22 104.72,26.26 95.4,26.26 86.62,26.26 86.16,26.72 79.19,26.72 78.7,26.23 68.9,26.23 67.86,27.28 58.57,27.28 48.37,27.28 41.49,34.15 | 168.98,25.7 156.01,25.7 139.04,25.7 123.05,25.7 122.54,26.22 | 122.53,26.23 122.54,26.22 | 42.85,7.91 47.31,3.45 63.25,3.45 82.73,3.45 101.65,3.45 119.56,3.45 137.8,3.45 156.79,3.45 170.22,3.45
  Top 0.813: 42.85,7.91 9.75,7.91 | 9.08,34.3 10.42,35.64 40.01,35.64 41.49,34.15
  Top 1.27: SV32.19 8.19,33.41 9.08,34.3 | SV32.1 8.19,9.47 9.75,7.91
VLED1
  Top 0.254: 40.25,22.54 21.94,22.54 21.83,22.65
  Top 0.305: D1.A 44.51,22.54 40.25,22.54
  Top 1.27: SV31.12 21.82,22.66 21.83,22.65
VLED2
  Top 0.254: 40.36,20.21 21.73,20.21 21.73,20.22
  Top 0.305: D2.A 40.36,20.21
  Top 1.27: SV31.10 21.63,20.12 21.73,20.21
VLED3
  Top 0.254: D3.A 49.36,22.39 48.34,23.41 22.63,23.41 21.93,24.1 19.33,24.1 18.94,24.5 18.94,24.55
  Top 0.305: D3.A
  Top 1.27: SV31.13 18.29,25.2 18.94,24.55
VLED4
  Top 0.254: D4.A 49.32,20.19 48.07,18.94 19.4,18.94 19.01,18.55
  Top 1.27: SV31.7 19.01,18.53 19.01,18.55
VLED5
  Top 0.254: 81.27,22.47 81.23,22.43 67.6,22.43 66.66,23.38 62.22,23.38 61.68,22.84 49.49,22.84 48.51,23.81 23.11,23.81 21.78,25.15
  Top 0.305: 81.27,22.47 D5.A
  Top 1.27: SV31.14 21.73,25.2 21.78,25.15
VLED6
  Top 0.254: 81.11,20.19 67.64,20.19 66.66,19.21 61.38,19.21 60.81,19.78 49.61,19.78 48.36,18.53 26.04,18.53 25.18,17.67 21.82,17.67
  Top 0.305: 81.11,20.19 D6.A
  Top 1.27: SV31.8 21.73,17.58 21.82,17.67
VLED7
  Top 0.254: D7.A 86,22.43 84.99,23.43 80.33,23.43 79.75,22.85 67.81,22.85 66.87,23.79 62.06,23.79 61.51,23.24 49.65,23.24 48.68,24.22 24.72,24.22 22.29,26.65 19.26,26.65 18.9,27.01
  Top 1.27: SV31.15 18.78,27.01 18.9,27.01
VLED8
  Top 0.254: D8.A 86,20.22 84.99,19.21 79.77,19.21 79.2,19.79 67.8,19.79 66.82,18.81 61.21,18.81 60.64,19.37 49.84,19.37 48.59,18.13 26.81,18.13 25.12,16.44 19.36,16.44 18.83,15.91
  Top 1.27: SV31.5 18.83,15.81 18.83,15.91
VLED9
  Top 0.254: D9.A 117.99,22.47 104.45,22.47 103.51,23.41 99.08,23.41 98.53,22.86 86.14,22.86 85.16,23.84 80.17,23.84 79.59,23.27 67.96,23.27 67.03,24.19 61.89,24.19 61.34,23.65 49.82,23.65 48.85,24.63 25.41,24.63 22.28,27.76 21.9,27.76
  Top 1.27: SV31.16 21.88,27.74 21.9,27.76
VLED10
  Top 0.254: D10.A 104.49,20.22 103.51,19.24 97.84,19.24 97.27,19.81 86.17,19.81 85.16,18.81 79.6,18.81 79.03,19.38 67.97,19.38 66.99,18.4 61.04,18.4 60.48,18.96 50.06,18.96 48.81,17.72 27.66,17.72 25.09,15.15 21.91,15.15
  Top 1.27: SV31.6 21.8,15.04 21.91,15.15
VLED11
  Top 0.254: D11.A 122.73,22.43 121.77,23.38 117.34,23.38 116.84,22.88 104.61,22.88 103.68,23.81 98.91,23.81 98.36,23.27 86.31,23.27 85.33,24.25 80,24.25 79.43,23.68 68.13,23.68 67.2,24.6 61.72,24.6 61.18,24.06 49.99,24.06 49.02,25.03 26.34,25.03 22.14,29.23 19.04,29.23 18.64,29.63
  Top 1.27: SV31.17 18.64,29.69 18.64,29.63
VLED12
  Top 0.254: D12.A 122.75,20.22 121.77,19.24 117.27,19.24 116.73,19.79 104.63,19.79 103.68,18.83 97.67,18.83 97.1,19.41 86.34,19.41 85.33,18.4 79.43,18.4 78.86,18.97 68.14,18.97 67.16,17.99 60.87,17.99 60.31,18.56 50.22,18.56 48.98,17.31 28.4,17.31 25.03,13.94 19.36,13.94 18.85,13.43
  Top 1.27: SV31.3 18.85,13.29 18.85,13.43
VLED13
  Top 0.254: D13.A 141.33,22.4 140.32,23.41 135.88,23.41 135.31,22.84 122.89,22.84 121.94,23.79 117.17,23.79 116.68,23.29 104.78,23.29 103.85,24.22 98.73,24.22 98.18,23.67 86.48,23.67 85.5,24.65 79.83,24.65 79.26,24.08 68.3,24.08 67.37,25.01 61.55,25.01 61.01,24.46 50.16,24.46 49.18,25.44 27.09,25.44 22.24,30.28 21.81,30.28
  Top 1.27: SV31.18 21.81,30.28
VLED14
  Top 0.254: D14.A 141.27,20.19 140.32,19.24 135.88,19.24 135.31,19.81 122.92,19.81 121.94,18.83 117.11,18.83 116.56,19.38 104.8,19.38 103.85,18.43 97.5,18.43 96.93,19 86.5,19 85.5,17.99 79.27,17.99 78.69,18.57 68.31,18.57 67.33,17.59 60.7,17.59 60.14,18.15 50.39,18.15 49.15,16.91 29.24,16.91 24.93,12.6 21.8,12.6
  Top 1.27: SV31.4 21.7,12.5 21.8,12.6
VLED15
  Top 0.254: D15.A 159.61,22.4 158.63,23.38 154.2,23.38 153.62,22.8 141.49,22.8 140.48,23.81 135.72,23.81 135.15,23.24 123.06,23.24 122.11,24.19 117,24.19 116.51,23.7 104.95,23.7 104.02,24.63 98.56,24.63 98.02,24.08 86.65,24.08 85.67,25.06 79.66,25.06 79.09,24.49 68.47,24.49 67.54,25.41 61.38,25.41 60.84,24.87 50.33,24.87 49.35,25.85 27.99,25.85 22.17,31.66 19.53,31.66 19,32.19
  Top 1.27: SV31.19 18.38,32.82 19,32.19
VLED16
  Top 0.254: D16.A 159.58,20.17 158.63,19.21 154.2,19.21 153.62,19.79 141.44,19.79 140.48,18.83 135.72,18.83 135.14,19.41 123.09,19.41 122.11,18.43 116.94,18.43 116.39,18.97 104.97,18.97 104.02,18.02 97.34,18.02 96.76,18.59 86.67,18.59 85.67,17.59 79.1,17.59 78.52,18.16 68.48,18.16 67.5,17.18 60.53,17.18 59.97,17.74 50.56,17.74 49.31,16.5 30.29,16.5 25.01,11.22 19.27,11.22 18.9,10.86
  Top 1.27: SV31.1 18.9,10.81 18.9,10.86
VLED17
  Top 0.254: D17.A 178.21,22.37 177.2,23.38 172.76,23.38 172.19,22.81 159.78,22.81 158.8,23.79 154.03,23.79 153.45,23.21 141.66,23.21 140.65,24.22 135.55,24.22 134.98,23.65 123.23,23.65 122.28,24.6 116.84,24.6 116.34,24.1 105.11,24.1 104.18,25.03 98.39,25.03 97.85,24.49 86.81,24.49 85.84,25.46 79.49,25.46 78.92,24.89 68.63,24.89 67.71,25.82 61.21,25.82 60.67,25.28 50.5,25.28 49.52,26.25 28.44,26.25 21.88,32.82
  Top 0.305: D17.A 191.94,22.07
  Top 1.27: SV31.20 21.88,32.82
VLED18
  Top 0.254: D18.A 178.17,20.16 177.2,19.19 172.76,19.19 172.19,19.76 159.75,19.76 158.8,18.81 154.03,18.81 153.46,19.38 141.61,19.38 140.65,18.43 135.55,18.43 134.97,19 123.26,19 122.28,18.02 116.77,18.02 116.22,18.57 105.14,18.57 104.18,17.61 97.17,17.61 96.59,18.19 86.84,18.19 85.84,17.18 78.93,17.18 78.36,17.75 68.65,17.75 67.67,16.77 60.37,16.77 59.8,17.34 50.73,17.34 49.48,16.09 31.59,16.09 25.59,10.1 21.98,10.1
  Top 1.27: SV31.2 20.73,10.1 21.98,10.1

### Text on the board
tPlace: A8 | D17 | D18
bPlace: GND | GND | GND | GND | GND | GND | GND | GND | +V | +V | +V | +V | +V | +V | +V | +V | AOUT | AOUT | AOUT | AOUT | AOUT | AOUT | AOUT | AOUT | GND | GND | GND | GND | GND | GND | GND | GND | +V | +V | +V | +V | +V | +V | +V | +V | AOUT | AOUT | AOUT | AOUT | AOUT | AOUT | AOUT | AOUT
bNames: JOSHUA BREWSTER (MIT LICENSE)
tValues: A1 | A2 | A3 | A4 | A5 | A6 | A7 | A9 | A10 | A11 | A12 | A13 | A14 | A8 | A15
tDocu: BASED ON pnas.org/content/104/29/12169 | 16 optical channels, 9 LED pairs / Forehead DIY-DOT | Use OPT101 (the cheap aliexpress ones) / and 1206 spec LEDs